# EAGLE schematic Botdozer (EAGLE 7.4.0)
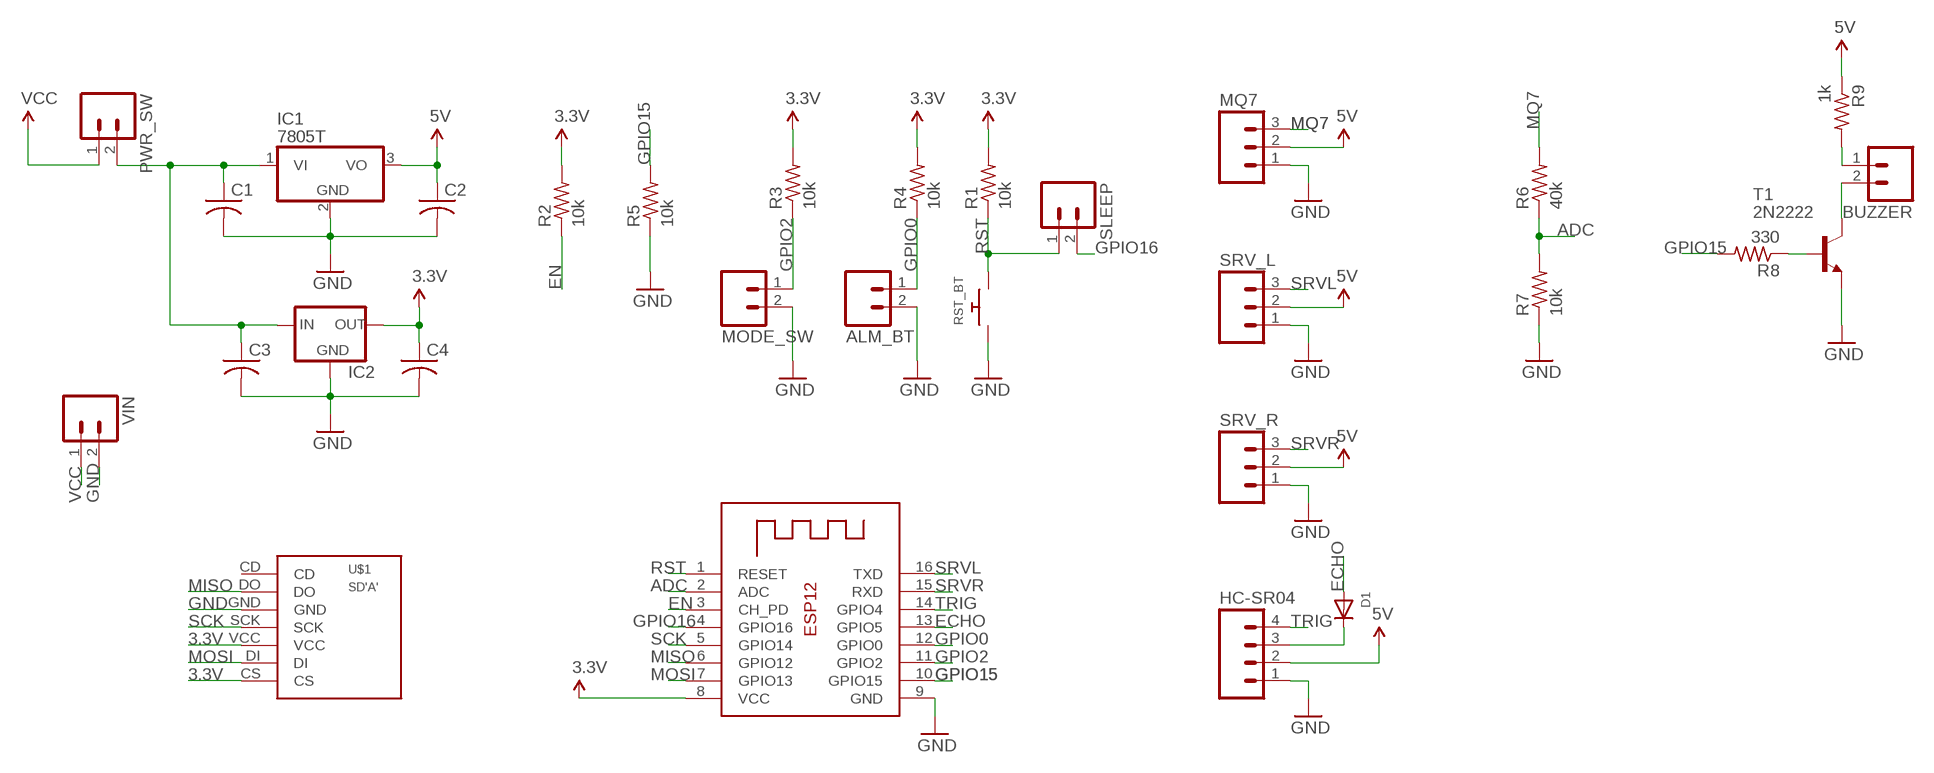
[diagram p0: schematic, sheet 1]

## Parts
ALM_BT  M02PTH  [1X02]
BUZZER  M02PTH  [1X02]
C1  C-US025-025X050  [C025-025X050]
C2  C-US025-025X050  [C025-025X050]
C3  C-US025-025X050  [C025-025X050]
C4  C-US025-025X050  [C025-025X050]
D1  DIODEDO-1N4148  [DO-1N4148]
HC-SR04  M04PTH  [1X04]
IC1  7805T  [TO220H]
IC2  78XXL  [78XXL]
MODE_SW  M02PTH  [1X02]
MQ7  M03PTH  [1X03]
PWR_SW  M02PTH  [1X02]
R1  10k  R-US_0207/10  [0207/10]
R2  10k  R-US_0207/10  [0207/10]
R3  10k  R-US_0207/10  [0207/10]
R4  10k  R-US_0207/10  [0207/10]
R5  10k  R-US_0207/10  [0207/10]
R6  40k  R-US_0207/10  [0207/10]
R7  10k  R-US_0207/10  [0207/10]
R8  330  R-US_0207/10  [0207/10]
R9  1k  R-US_0207/10  [0207/10]
RST_BT  SWITCH_PUSHBUTTONEVQ-PE  [TACT_PANA-EVQ]
SLEEP  M02PTH  [1X02]
SRV_L  M03PTH  [1X03]
SRV_R  M03PTH  [1X03]
T1  2N2222  [TO92-EBC-OVAL]
U$1  SD'A'  [SD_BR]
VIN  M02PTH  [1X02]
X1  ESP-12  [ESP-12]

## Nets
3.3V: C4.1 IC2.OUT R1.2 R2.2 R3.2 R4.2 U$1.CS U$1.VCC X1.8(VCC)
5V: C2.1 HC-SR04.2 IC1.3(VO) MQ7.2 R9.1 SRV_L.2 SRV_R.2
ADC: R6.1 R7.2 X1.2(ADC)
ECHO: D1.A X1.13(GPIO5)
EN: R2.1 X1.3(CH_PD)
GND: ALM_BT.2 C1.2 C2.2 C3.2 C4.2 HC-SR04.1 IC1.2(GND) IC2.GND MODE_SW.2 MQ7.1 R5.1 R7.1 RST_BT.P$1 SRV_L.1 SRV_R.1 T1.E U$1.GND VIN.2 X1.9(GND)
GPIO0: ALM_BT.1 R4.1 X1.12(GPIO0)
GPIO2: MODE_SW.1 R3.1 X1.11(GPIO2)
GPIO15: R5.2 R8.2 X1.10(GPIO15)
GPIO16: SLEEP.2 X1.4(GPIO16)
MISO: U$1.DO X1.6(GPIO12)
MOSI: U$1.DI X1.7(GPIO13)
MQ7: MQ7.3 R6.2
N$1: BUZZER.2 T1.C
N$2: R8.1 T1.B
N$3: C1.1 C3.1 IC1.1(VI) IC2.IN PWR_SW.2
N$4: BUZZER.1 R9.2
N$5: D1.C HC-SR04.3
RST: R1.1 RST_BT.P$2 SLEEP.1 X1.1(RESET)
SCK: U$1.SCK X1.5(GPIO14)
SRVL: SRV_L.3 X1.16(TXD)
SRVR: SRV_R.3 X1.15(RXD)
TRIG: HC-SR04.4 X1.14(GPIO4)
VCC: PWR_SW.1 VIN.1
Unconnected: U$1.CD

## Library data of the parts
ALM_BT BUZZER MODE_SW PWR_SW SLEEP VIN = SparkFun-Connectors:M02: Standard 2-pin 0.1" header. Use with - straight break away headers ( PRT-00116) - right angle break away headers (PRT-00553) - swiss pins (PRT-00743) - machine pins (PRT-00117) - female headers (PRT-00115) Molex polarized connector foot print use with: PRT-08233 with associated crimp pins and housings. 2.54_SCREWTERM for use with PRT-10571. 3.5mm Screw Terminal footprints for PRT-08084 5mm Screw Terminal footprints for use with PRT-08432
C1-C4 = adafruit:C-US: CAPACITOR, American symbol
D1 = adafruit:DIODE: Diode SMADIODE - SMA Surface Mount Package 20V 1A Schottky Diode Digikey: 641-1014-6-ND DO-1N4148 - Through Hole Small Current Diode SOD-123 20V 1 A (.5mV Vf) Schottky Diode - Digikey: MBRX120TPMSCT-ND SOD-323 10V 570mA (.38mV Vf, 3ns) Schottky Diode - Digikey: ZLLS410CT-ND SOD-523 30V 30mA Schottky Diode (RB751S-40TE61) - Digikey: RB751S-40TE61CT-ND SOT23-R/W - SOT23 Package (R = Solder Paste/Reflow Ovens, W = Hand-Soldering) BAT54Film 40V 300mA - Digikey: 497-7162-1-ND
HC-SR04 = SparkFun-Connectors:M04: Header 4 Standard 4-pin 0.1" header. Use with straight break away headers (SKU : PRT-00116), right angle break away headers (PRT-00553), swiss pins (PRT-00743), machine pins (PRT-00117), and female headers (PRT-00115). Molex polarized connector foot print use with SKU : PRT-08231 with associated crimp pins and housings. 1MM SMD Version SKU: PRT-10208; PROD_ID: CONN-09696
IC1 = adafruit:78*: Positive VOLTAGE REGULATOR Added bigger pads to the TO-92 package
IC2 = v-reg:78XXL: VOLTAGE REGULATOR
MQ7 SRV_L SRV_R = SparkFun-Connectors:M03: Header 3 Standard 3-pin 0.1" header. Use with straight break away headers (SKU : PRT-00116), right angle break away headers (PRT-00553), swiss pins (PRT-00743), machine pins (PRT-00117), and female headers (PRT-00115). Molex polarized connector foot print use with SKU : PRT-08232 with associated crimp pins and housings.
R1-R9 = adafruit:R-US_: RESISTOR, American symbol
RST_BT = adafruit:SWITCH_PUSHBUTTON: Buttons SOFTTOUCHSMD_SJ - Soft touch temporary push button (Super Junk Akihabara) Compatible with SKPMANE010 [Mouser: 688-SKPMAN] C&K_KSS = Digikey: KSS221GLFS
T1 = adafruit:2N2222: NPN TRANSISTOR Big oval pads
U$1 = rac:SD
X1 = adafruit:ESP-12